# EAGLE schematic ratty (EAGLE 7.5.0)
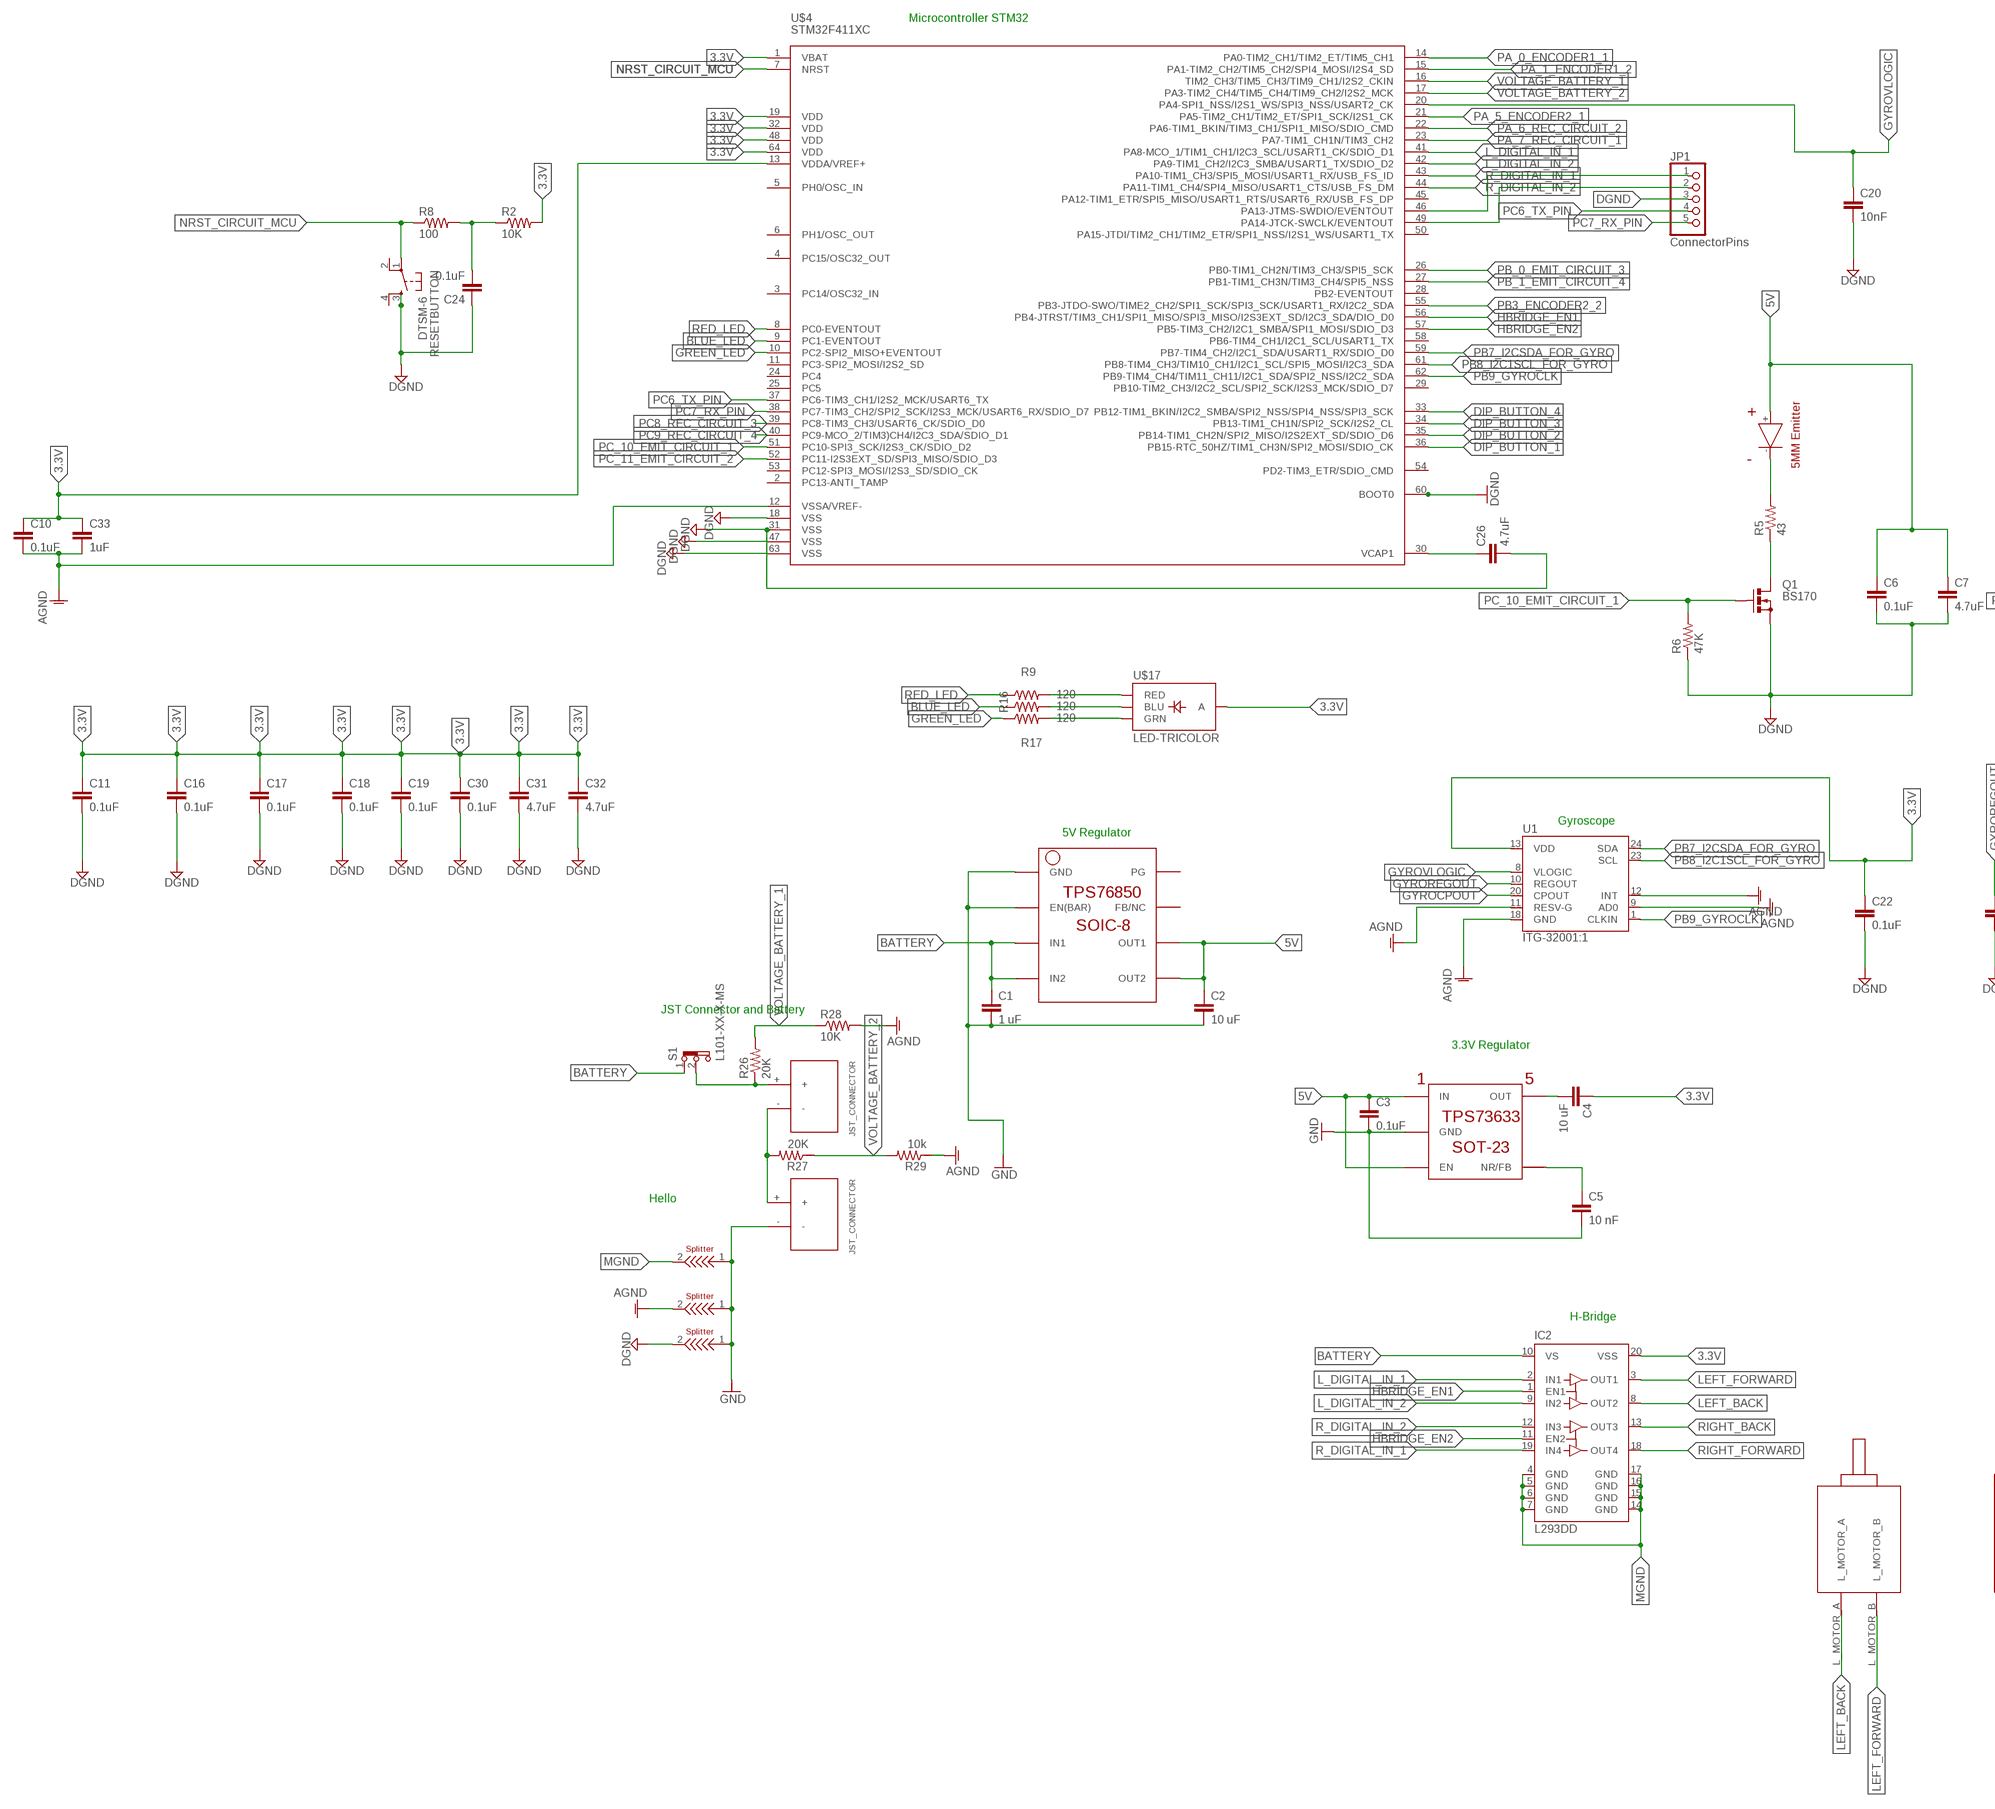
[diagram p0: schematic, sheet 1, part 1 of 2]
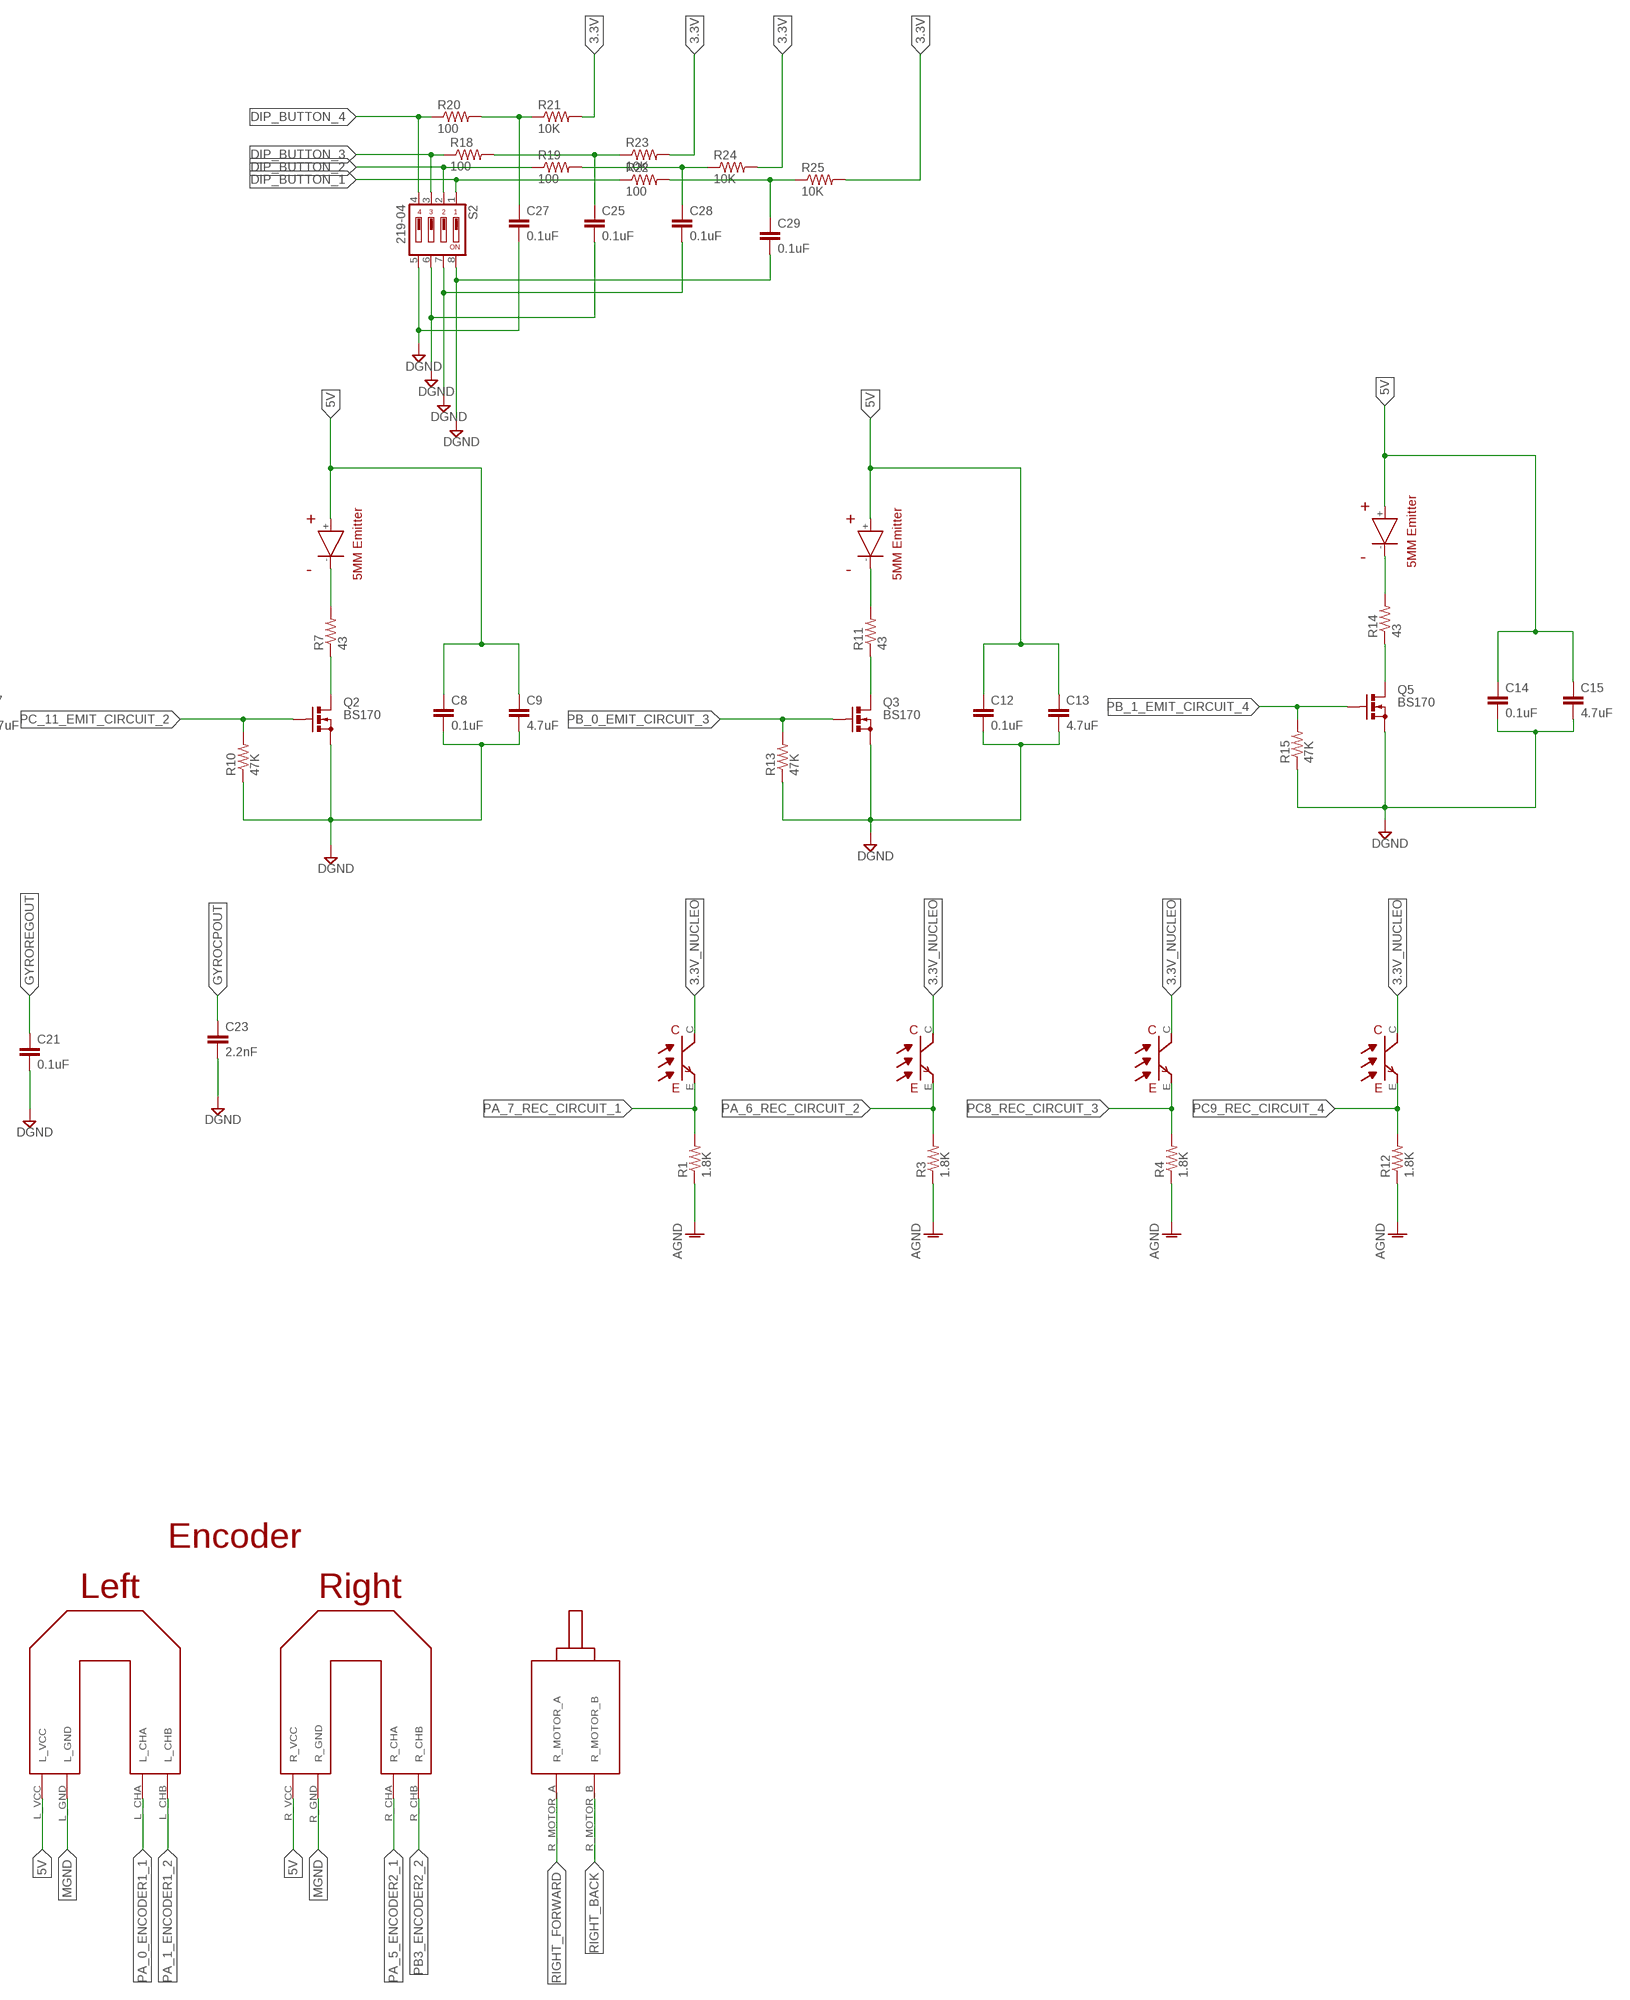
[diagram p1: schematic, sheet 1, part 2 of 2]

## Parts
A_SPLITTER  SPLITTER  [SPLITTER]
C1  1 uF  C-EUC0603  [C0603]
C2  10 uF  C-EUC0603  [C0603]
C3  0.1uF  C-EUC0603  [C0603]
C4  10 uF  C-EUC0603  [C0603]
C5  10 nF  C-EUC0603  [C0603]
C6  0.1uF  C-EUC0603  [C0603]
C7  4.7uF  C-EUC0603  [C0603]
C8  0.1uF  C-EUC0603  [C0603]
C9  4.7uF  C-EUC0603  [C0603]
C10  0.1uF  C-EUC0603  [C0603]
C11  0.1uF  C-EUC0603  [C0603]
C12  0.1uF  C-EUC0603  [C0603]
C13  4.7uF  C-EUC0603  [C0603]
C14  0.1uF  C-EUC0603  [C0603]
C15  4.7uF  C-EUC0603  [C0603]
C16  0.1uF  C-EUC0603  [C0603]
C17  0.1uF  C-EUC0603  [C0603]
C18  0.1uF  C-EUC0603  [C0603]
C19  0.1uF  C-EUC0603  [C0603]
C20  10nF  C-EUC0603  [C0603]
C21  0.1uF  C-EUC0603  [C0603]
C22  0.1uF  C-EUC0603  [C0603]
C23  2.2nF  C-EUC0603  [C0603]
C24  0.1uF  C-EUC0603  [C0603]
C25  0.1uF  C-EUC0603  [C0603]
C26  4.7uF  C-EUC0603  [C0603]
C27  0.1uF  C-EUC0603  [C0603]
C28  0.1uF  C-EUC0603  [C0603]
C29  0.1uF  C-EUC0603  [C0603]
C30  0.1uF  C-EUC0603  [C0603]
C31  4.7uF  C-EUC0603  [C0603]
C32  4.7uF  C-EUC0603  [C0603]
C33  1uF  C-EUC0603  [C0603]
D_SPLITTER  SPLITTER  [SPLITTER]
IC2  L293DD  [SO20]
JP1  ConnectorPins  PINHD-1X5  [1X05]
M_SPLITTER  SPLITTER  [SPLITTER]
Q1  BS170  [SOT54E]
Q2  BS170  [SOT54E]
Q3  BS170  [SOT54E]
Q5  BS170  [SOT54E]
R1  1.8K  R-US_R0603  [R0603]
R2  10K  R-US_R0603  [R0603]
R3  1.8K  R-US_R0603  [R0603]
R4  1.8K  R-US_R0603  [R0603]
R5  43  R-US_R1206  [R1206]
R6  47K  R-US_R0603  [R0603]
R7  43  R-US_R1206  [R1206]
R8  100  R-US_R0603  [R0603]
R9  120  R-US_R0603  [R0603]
R10  47K  R-US_R0603  [R0603]
R11  43  R-US_R1206  [R1206]
R12  1.8K  R-US_R0603  [R0603]
R13  47K  R-US_R0603  [R0603]
R14  43  R-US_R1206  [R1206]
R15  47K  R-US_R0603  [R0603]
R16  120  R-US_R0603  [R0603]
R17  120  R-US_R0603  [R0603]
R18  100  R-US_R0603  [R0603]
R19  100  R-US_R0603  [R0603]
R20  100  R-US_R0603  [R0603]
R21  10K  R-US_R0603  [R0603]
R22  100  R-US_R0603  [R0603]
R23  10K  R-US_R0603  [R0603]
R24  10K  R-US_R0603  [R0603]
R25  10K  R-US_R0603  [R0603]
R26  20K  R-US_R0603  [R0603]
R27  20K  R-US_R0603  [R0603]
R28  10K  R-US_R0603  [R0603]
R29  10k  R-US_R0603  [R0603]
RESETBUTTON  DTSM-6  [DTSM-6]
S1  L101-XX-X-MS  [L101-XX-X-MS]
S2  219-04  [CTS-219-04]
U1  ITG-32001:1  [QFN-24_ITG3200_1:1]
U$1  JST_CONNECTOR_FEMALE  [JST_CONNECTOR_FEMALE]
U$2  JST_CONNECTOR_FEMALE  [JST_CONNECTOR_FEMALE]
U$3  TPS76850(SOIC-8)  [TPS76850(SOIC-8)]
U$4  STM32F411XC  [LQFP64]
U$5  TPS73633(SOT-23)  [TPS73633(SOT-23)]
U$6  RECEIVER  [RECEIVER]
U$8  FUTURA_V1.0_MOTOR_MOUNT  [FUTURA_V1.0_MOTOT_MOUNT]
U$9  RECEIVER  [RECEIVER]
U$11  RECEIVER  [RECEIVER]
U$13  RECEIVER  [RECEIVER]
U$15  EMITTER  [EMITTER]
U$16  EMITTER  [EMITTER]
U$17  LED-TRICOLOR  [LED-TRICOLOR-SMD]
U$18  EMITTER  [EMITTER]
U$19  EMITTER  [EMITTER]

## Nets
3.3V: C4.1 C10.1 C11.1 C16.1 C17.1 C18.1 C19.1 C22.1 C30.1 C31.1 C32.1 C33.1 IC2.20(VSS) R2.2 R21.2 R23.2 R24.2 R25.2 U1.13(VDD) U$4.1(VBAT) U$4.13(VDDA/VREF+) U$4.19(VDD) U$4.32(VDD) U$4.48(VDD) U$4.64(VDD) U$17.A
3.3V_NUCLEO: U$6.C U$9.C U$11.C U$13.C
5V: C2.1 C3.1 C6.1 C7.1 C8.1 C9.1 C12.1 C13.1 C14.1 C15.1 U$3.OUT1 U$3.OUT2 U$5.EN U$5.IN U$8.L_VCC U$8.R_VCC U$15.+ U$16.+ U$18.+ U$19.+
AGND: A_SPLITTER.2 C10.2 C33.2 R1.1 R3.1 R4.1 R12.1 R28.2 R29.1 U1.9(AD0) U1.11(RESV-G) U1.12(INT) U1.18(GND) U$4.12(VSSA/VREF-)
BATTERY: C1.1 IC2.10(VS) S1.1 U$3.IN1 U$3.IN2
BATTERY_1: R26.1 S1.2 U$1.+
BATTERY_2: R27.2 U$1.- U$2.+
BLUE_LED: R16.1 U$4.9(PC1-EVENTOUT)
DGND: C6.2 C7.2 C8.2 C9.2 C11.2 C12.2 C13.2 C14.2 C15.2 C16.2 C17.2 C18.2 C19.2 C20.2 C21.2 C22.2 C23.2 C24.1 C25.2 C26.2 C27.2 C28.2 C29.2 C30.2 C31.2 C32.2 D_SPLITTER.2 JP1.3 Q1.S Q2.S Q3.S Q5.S R6.1 R10.1 R13.1 R15.1 RESETBUTTON.3 S2.5 S2.6 S2.7 S2.8 U$4.18(VSS) U$4.31(VSS) U$4.47(VSS) U$4.60(BOOT0) U$4.63(VSS)
DIP_BUTTON_1: R22.1 S2.1 U$4.36(PB15-RTC_50HZ/TIM1_CH3N/SPI2_MOSI/SDIO_CK)
DIP_BUTTON_2: R19.1 S2.2 U$4.35(PB14-TIM1_CH2N/SPI2_MISO/I2S2EXT_SD/SDIO_D6)
DIP_BUTTON_3: R18.1 S2.3 U$4.34(PB13-TIM1_CH1N/SPI2_SCK/I2S2_CL)
DIP_BUTTON_4: R20.1 S2.4 U$4.33(PB12-TIM1_BKIN/I2C2_SMBA/SPI2_NSS/SPI4_NSS/SPI3_SCK)
GND: A_SPLITTER.1 C1.2 C2.2 C3.2 C5.2 D_SPLITTER.1 M_SPLITTER.1 U$2.- U$3.EN(BAR) U$3.GND U$5.GND
GREEN_LED: R17.1 U$4.10(PC2-SPI2_MISO+EVENTOUT)
GYROCPOUT: C23.1 U1.20(CPOUT)
GYROREGOUT: C21.1 U1.10(REGOUT)
GYROVLOGIC: C20.1 U1.8(VLOGIC) U$4.20(PA4-SPI1_NSS/I2S1_WS/SPI3_NSS/USART2_CK)
HBRIDGE_EN1: IC2.1(EN1) U$4.56(PB4-JTRST/TIM3_CH1/SPI1_MISO/SPI3_MISO/I2S3EXT_SD/I2C3_SDA/DIO_D0)
HBRIDGE_EN2: IC2.11(EN2) U$4.57(PB5-TIM3_CH2/I2C1_SMBA/SPI1_MOSI/SDIO_D3)
L_DIGITAL_IN_1: IC2.2(IN1) U$4.41(PA8-MCO_1/TIM1_CH1/I2C3_SCL/USART1_CK/SDIO_D1)
L_DIGITAL_IN_2: IC2.9(IN2) U$4.42(PA9-TIM1_CH2/I2C3_SMBA/USART1_TX/SDIO_D2)
LED/R5: R5.2 U$15.-
LED/R7: R7.2 U$16.-
LED/R11: R11.2 U$18.-
LED/R14: R14.2 U$19.-
LEFT_BACK: IC2.8(OUT2) U$8.L_MOTOR_A
LEFT_FORWARD: IC2.3(OUT1) U$8.L_MOTOR_B
MGND: IC2.4(GND) IC2.5(GND) IC2.6(GND) IC2.7(GND) IC2.14(GND) IC2.15(GND) IC2.16(GND) IC2.17(GND) M_SPLITTER.2 U$8.L_GND U$8.R_GND
N$2: C24.2 R2.1 R8.2
N$13: JP1.1 U$4.46(PA13-JTMS-SWDIO/EVENTOUT)
N$14: JP1.2 U$4.49(PA14-JTCK-SWCLK/EVENTOUT)
N$16: C26.1 U$4.30(VCAP1)
N$18: R9.2 U$17.R(RED)
N$19: R16.2 U$17.B(BLU)
N$20: R17.2 U$17.G(GRN)
NRST_CIRCUIT_MCU: R8.1 RESETBUTTON.1 U$4.7(NRST)
PA_0_ENCODER1_1: U$4.14(PA0-TIM2_CH1/TIM2_ET/TIM5_CH1) U$8.L_CHA
PA_1_ENCODER1_2: U$4.15(PA1-TIM2_CH2/TIM5_CH2/SPI4_MOSI/I2S4_SD) U$8.L_CHB
PA_5_ENCODER2_1: U$4.21(PA5-TIM2_CH1/TIM2_ET/SPI1_SCK/I2S1_CK) U$8.R_CHA
PA_6_REC_CIRCUIT_2: R3.2 U$4.22(PA6-TIM1_BKIN/TIM3_CH1/SPI1_MISO/SDIO_CMD) U$9.E
PA_7_REC_CIRCUIT_1: R1.2 U$4.23(PA7-TIM1_CH1N/TIM3_CH2) U$6.E
PB3_ENCODER2_2: U$4.55(PB3-JTDO-SWO/TIME2_CH2/SPI1_SCK/SPI3_SCK/USART1_RX/I2C2_SDA) U$8.R_CHB
PB7_I2CSDA_FOR_GYRO: U1.24(SDA) U$4.59(PB7-TIM4_CH2/I2C1_SDA/USART1_RX/SDIO_D0)
PB8_I2C1SCL_FOR_GYRO: U1.23(SCL) U$4.61(PB8-TIM4_CH3/TIM10_CH1/I2C1_SCL/SPI5_MOSI/I2C3_SDA)
PB9_GYROCLK: U1.1(CLKIN) U$4.62(PB9-TIM4_CH4/TIM11_CH11/I2C1_SDA/SPI2_NSS/I2C2_SDA)
PB_0_EMIT_CIRCUIT_3: Q3.G R13.2 U$4.26(PB0-TIM1_CH2N/TIM3_CH3/SPI5_SCK)
PB_1_EMIT_CIRCUIT_4: Q5.G R15.2 U$4.27(PB1-TIM1_CH3N/TIM3_CH4/SPI5_NSS)
PC6_TX_PIN: JP1.4 U$4.37(PC6-TIM3_CH1/I2S2_MCK/USART6_TX)
PC7_RX_PIN: JP1.5 U$4.38(PC7-TIM3_CH2/SPI2_SCK/I2S3_MCK/USART6_RX/SDIO_D7)
PC8_REC_CIRCUIT_3: R4.2 U$4.39(PC8-TIM3_CH3/USART6_CK/SDIO_D0) U$11.E
PC9_REC_CIRCUIT_4: R12.2 U$4.40(PC9-MCO_2/TIM3)CH4/I2C3_SDA/SDIO_D1) U$13.E
PC_10_EMIT_CIRCUIT_1: Q1.G R6.2 U$4.51(PC10-SPI3_SCK/I2S3_CK/SDIO_D2)
PC_11_EMIT_CIRCUIT_2: Q2.G R10.2 U$4.52(PC11-I2S3EXT_SD/SPI3_MISO/SDIO_D3)
R_DIGITAL_IN_1: IC2.19(IN4) U$4.43(PA10-TIM1_CH3/SPI5_MOSI/USART1_RX/USB_FS_ID)
R_DIGITAL_IN_2: IC2.12(IN3) U$4.44(PA11-TIM1_CH4/SPI4_MISO/USART1_CTS/USB_FS_DM)
RED_LED: R9.1 U$4.8(PC0-EVENTOUT)
RIGHT_BACK: IC2.13(OUT3) U$8.R_MOTOR_B
RIGHT_FORWARD: IC2.18(OUT4) U$8.R_MOTOR_A
TO_C4_CAP: C4.2 U$5.OUT
TO_C5_CAP: C5.1 U$5.NR/FB
TO_Q1_MOS: Q1.D R5.1
TO_Q2_MOS: Q2.D R7.1
TO_Q3_MOS: Q3.D R11.1
TO_Q5_MOS: Q5.D R14.1
TO_R18/C25: C25.1 R18.2 R23.1
TO_R19/C28: C28.1 R19.2 R24.1
TO_R20/C27: C27.1 R20.2 R21.1
TO_R22/C29: C29.1 R22.2 R25.1
VOLTAGE_BATTERY_1: R26.2 R28.1 U$4.16(TIM2_CH3/TIM5_CH3/TIM9_CH1/I2S2_CKIN)
VOLTAGE_BATTERY_2: R27.1 R29.2 U$4.17(PA3-TIM2_CH4/TIM5_CH4/TIM9_CH2/I2S2_MCK)
Unconnected: RESETBUTTON.2 RESETBUTTON.4 U$3.FB/NC U$3.PG U$4.2(PC13-ANTI_TAMP) U$4.3(PC14/OSC32_IN) U$4.4(PC15/OSC32_OUT) U$4.5(PH0/OSC_IN) U$4.6(PH1/OSC_OUT) U$4.11(PC3-SPI2_MOSI/I2S2_SD) U$4.24(PC4) U$4.25(PC5) U$4.28(PB2-EVENTOUT) U$4.29(PB10-TIM2_CH3/I2C2_SCL/SPI2_SCK/I2S3_MCK/SDIO_D7) U$4.45(PA12-TIM1_ETR/SPI5_MISO/USART1_RTS/USART6_RX/USB_FS_DP) U$4.50(PA15-JTDI/TIM2_CH1/TIM2_ETR/SPI1_NSS/I2S1_WS/USART1_TX) U$4.53(PC12-SPI3_MOSI/I2S3_SD/SDIO_CK) U$4.54(PD2-TIM3_ETR/SDIO_CMD) U$4.58(PB6-TIM4_CH1/I2C1_SCL/USART1_TX)

## Notes on the sheet
- Microcontroller STM32
- Gyroscope
- 5V Regulator
- JST Connector and Battery
- 3.3V Regulator
- Hello
- H-Bridge

## Library data of the parts
A_SPLITTER D_SPLITTER M_SPLITTER = splitter:SPLITTER
C1-C33 = rcl:C-EU: CAPACITOR, European symbol
IC2 = st-microelectronics:L293DD: PUSH-PULL FOUR CHANNEL DRIVER WITH DIODES Source: http://www.st.com/stonline/books/pdf/docs/1330.pdf; OC_FARNELL: unknown
JP1 = pinhead:PINHD-1X5: PIN HEADER
Q1-Q3 Q5 = transistor-small-signal:BS170: N-CHANNEL MOS FET
R1-R4 R6 R10 R12 R13 R15 R20 R21 = resistor:R-US_: RESISTOR, American symbol
R5 R7-R9 R11 R14 R16-R19 R22-R29 = rcl:R-US_: RESISTOR, American symbol
RESETBUTTON = switch-tact:DTSM-6
S1 = switch-ck:L101-XX-X-MS: SLIDE SWITCH
S2 = switch-dil:219-04*: Surface Mount DIP Switch Series 219 SMT CTS Electronic Components Sourc: www.ctscorp.com; OC_FARNELL: unknown; OC_NEWARK: unknown
U1 = SparkFun-Sensors:ITG-3200: ITG-3200 3-axis gyro, digital output, qfn24 package; PROD_ID: IC-09685
U$1 U$2 = JST_CONNECTOR_FEMALE. through hole:JST_CONNECTOR_FEMALE
U$3 = TPS76850(SOIC-8):TPS76850(SOIC-8)
U$4 = stm32f411:STM32F411XC
U$5 = TPS73633(SOT-23):TPS73633(SOT-23)
U$6 U$9 U$11 U$13 = sfh4550 & teft4300:RECEIVER
U$8 = Futura 1.0 motor mount template:FUTURA_V1.0_MOTOR_MOUNT
U$15 U$16 U$18 U$19 = sfh4550 & teft4300:EMITTER
U$17 = LEDs:LED-TRICOLOR: Tri-Color LED SMD Proven layout and schematic for triple color LED in SMD package - common anode. Spark Fun Electronics SKU : COM-07844